# Altium schematic sheet LevelShifters_GPIOs.SchDoc
size A3; SheetNumber: 11; SheetTotal: 16
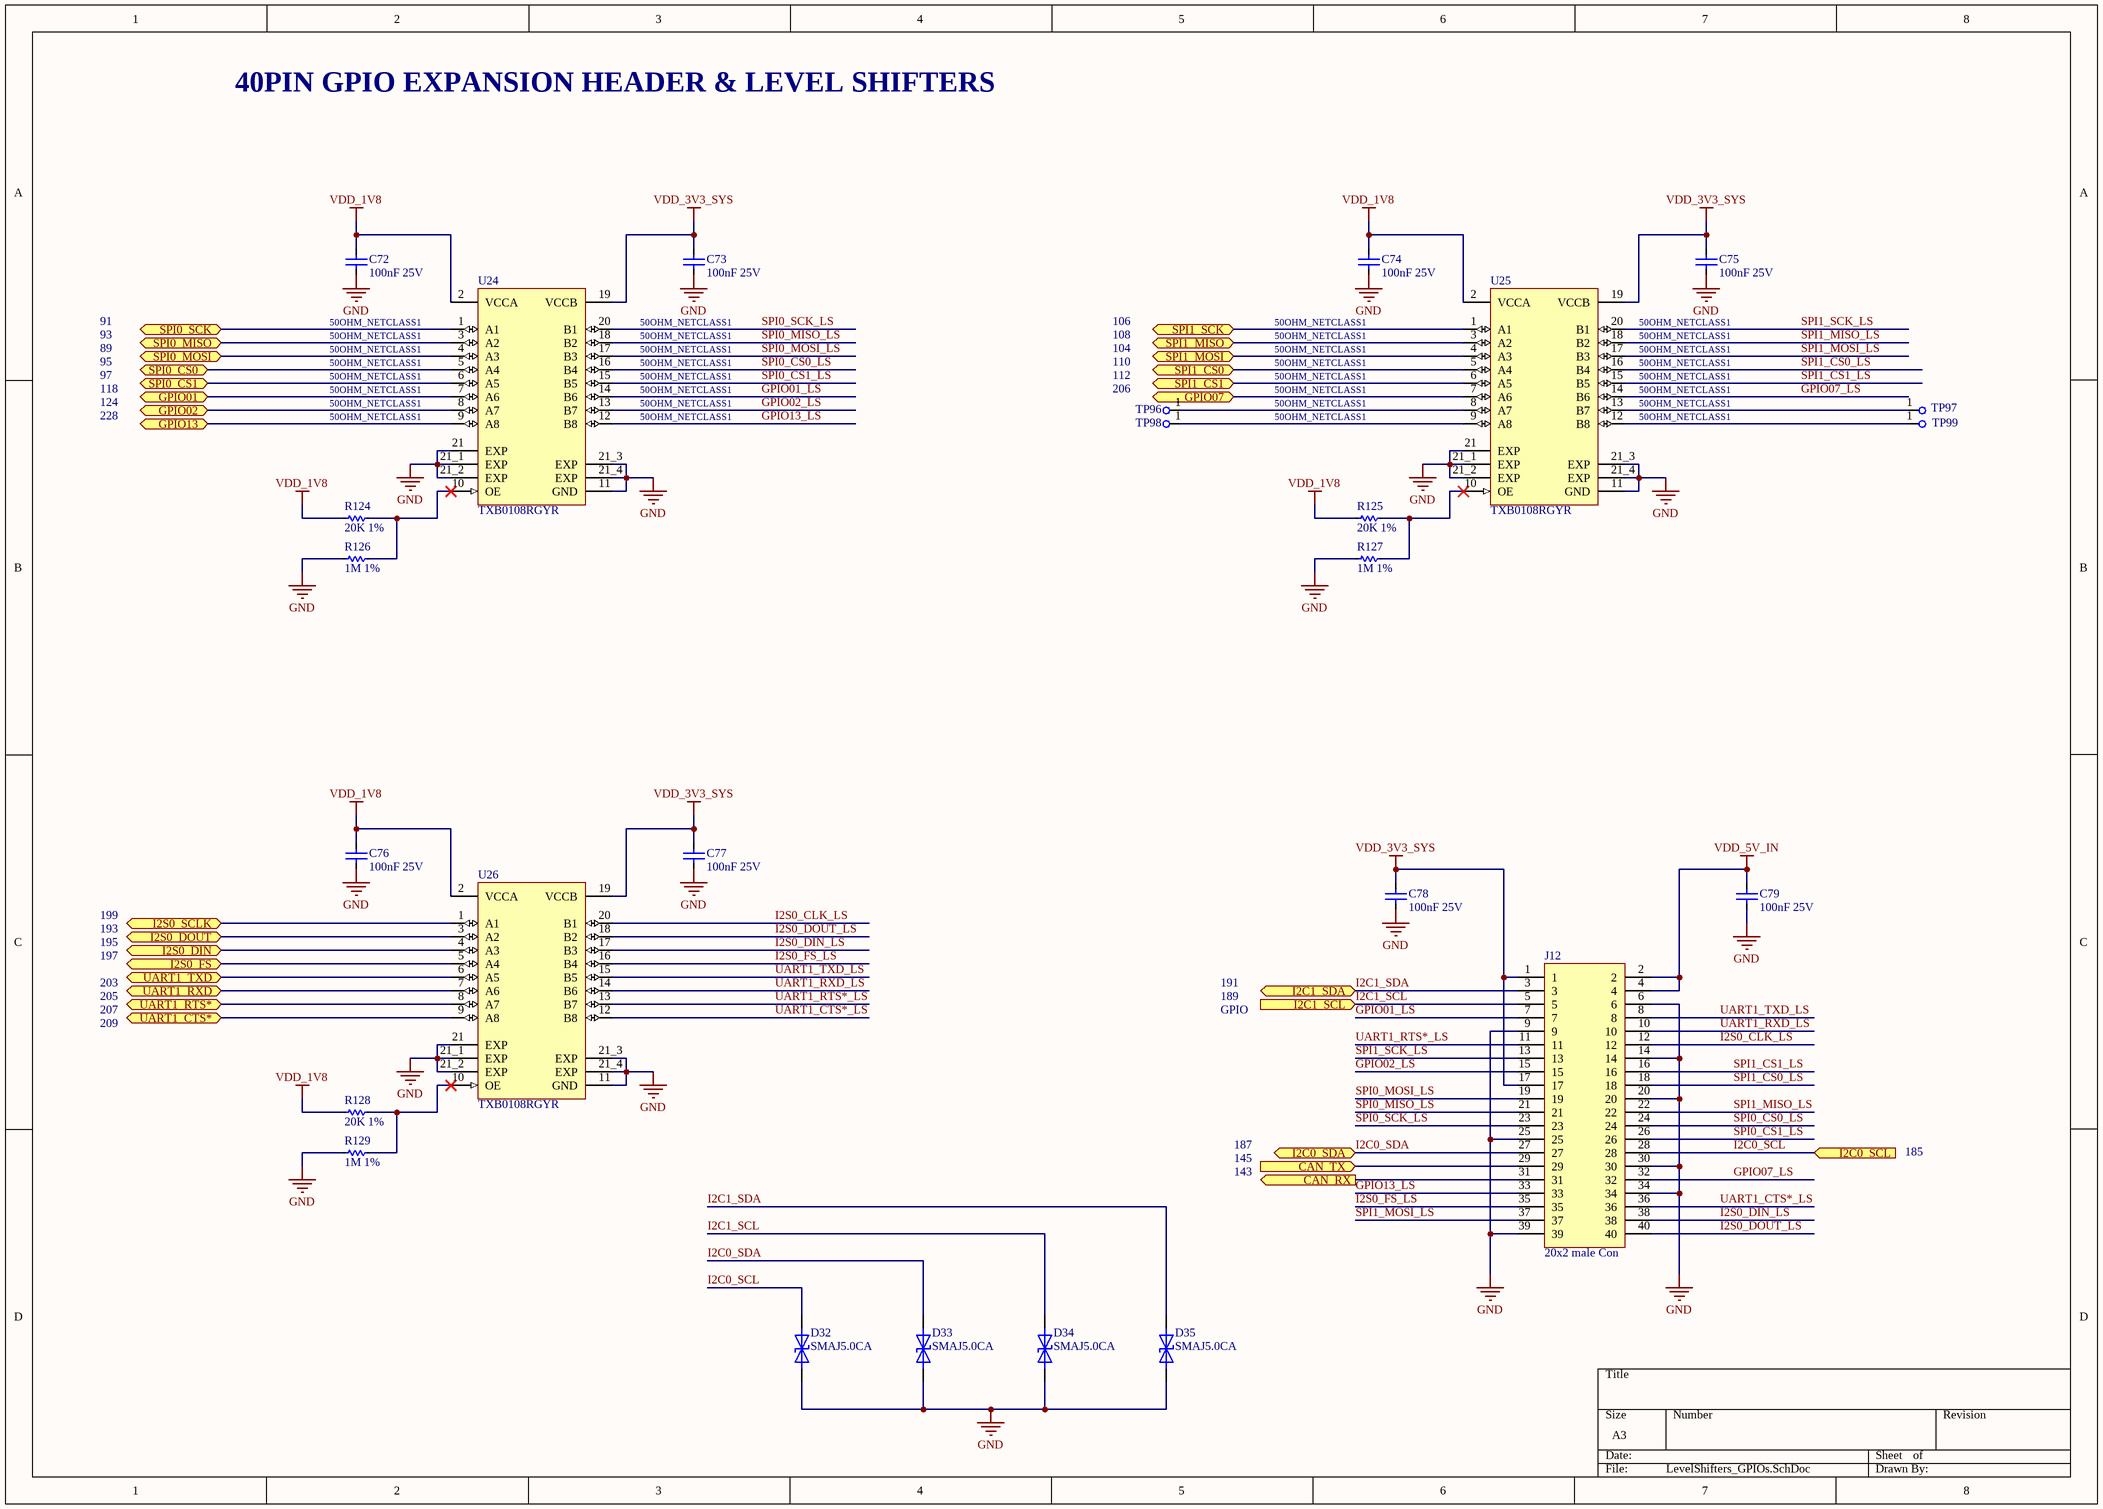
[diagram p0: LevelShifters_GPIOs.SchDoc]

## Parts
C72  100nF 25V  [C0402]
C73  100nF 25V  [C0402]
C74  100nF 25V  [C0402]
C75  100nF 25V  [C0402]
C76  100nF 25V  [C0402]
C77  100nF 25V  [C0402]
C78  100nF 25V  [C0402]
C79  100nF 25V  [C0402]
D32  SMAJ5.0CA  [DO-214AC]
D33  SMAJ5.0CA  [DO-214AC]
D34  SMAJ5.0CA  [DO-214AC]
D35  SMAJ5.0CA  [DO-214AC]
J12  20x2 male Con  [70246-4001]
R124  20K 1%  [R0402]
R125  20K 1%  [R0402]
R126  1M 1%  [R0402]
R127  1M 1%  [R0402]
R128  20K 1%  [R0402]
R129  1M 1%  [R0402]
TP96  (no value)  [TestPoint_Pad_D1.0mm]
TP97  TestPoint  [TestPoint_Pad_D1.0mm]  (value not drawn)
TP98  TestPoint  [TestPoint_Pad_D1.0mm]  (value not drawn)
TP99  TestPoint  [TestPoint_Pad_D1.0mm]  (value not drawn)
U24  TXB0108RGYR  [VQFN-20]
U25  TXB0108RGYR  [VQFN-20]
U26  TXB0108RGYR  [VQFN-20]

## Ports
CAN_RX (out), CAN_TX (in), GPIO01 (bidir), GPIO02 (bidir), GPIO07 (bidir), GPIO13 (bidir), I2C0_SCL (in), I2C0_SDA (bidir), I2C1_SCL (in), I2C1_SDA (bidir), I2S0_DIN (bidir), I2S0_DOUT (bidir), I2S0_FS (bidir), I2S0_SCLK (bidir), SPI0_CS0 (bidir), SPI0_CS1 (bidir), SPI0_MISO (bidir), SPI0_MOSI (bidir), SPI0_SCK (bidir), SPI1_CS0 (bidir), SPI1_CS1 (bidir), SPI1_MISO (bidir), SPI1_MOSI (bidir), SPI1_SCK (bidir), UART1_CTS* (bidir), UART1_RTS* (bidir), UART1_RXD (bidir), UART1_TXD (bidir)

## Nets
GND: C72.1 C73.1 C74.1 C75.1 C76.1 C77.1 C78.1 C79.1 D32.C D33.C D34.C D35.C J12.6 J12.9 J12.14 J12.20 J12.25 J12.30 J12.34 J12.39 R126.1 R127.1 R129.1 U24.11(GND) U24.21(EXP) U24.21_1(EXP) U24.21_2(EXP) U24.21_3(EXP) U24.21_4(EXP) U25.11(GND) U25.21(EXP) U25.21_1(EXP) U25.21_2(EXP) U25.21_3(EXP) U25.21_4(EXP) U26.11(GND) U26.21(EXP) U26.21_1(EXP) U26.21_2(EXP) U26.21_3(EXP) U26.21_4(EXP)
VDD_1V8: C72.2 C74.2 C76.2 R124.1 R125.1 R128.1 U24.2(VCCA) U25.2(VCCA) U26.2(VCCA)
VDD_3V3_SYS: C73.2 C75.2 C77.2 C78.2 J12.1 J12.17 U24.19(VCCB) U25.19(VCCB) U26.19(VCCB)
VDD_5V_IN: C79.2 J12.2 J12.4
CAN_RX: J12.31 ; port CAN_RX
CAN_TX: J12.29 ; port CAN_TX
GPIO01: U24.7(A6) ; port GPIO01
GPIO01_LS: J12.7 U24.14(B6)
GPIO02: U24.8(A7) ; port GPIO02
GPIO02_LS: J12.15 U24.13(B7)
GPIO07: U25.7(A6) ; port GPIO07
GPIO07_LS: J12.32 U25.14(B6)
GPIO13: U24.9(A8) ; port GPIO13
GPIO13_LS: J12.33 U24.12(B8)
I2C0_SCL: D32.A J12.28 ; port I2C0_SCL
I2C0_SDA: D33.A J12.27 ; port I2C0_SDA
I2C1_SCL: D34.A J12.5 ; port I2C1_SCL
I2C1_SDA: D35.A J12.3 ; port I2C1_SDA
I2S0_CLK_LS: J12.12 U26.20(B1)
I2S0_DIN: U26.4(A3) ; port I2S0_DIN
I2S0_DIN_LS: J12.38 U26.17(B3)
I2S0_DOUT: U26.3(A2) ; port I2S0_DOUT
I2S0_DOUT_LS: J12.40 U26.18(B2)
I2S0_FS: U26.5(A4) ; port I2S0_FS
I2S0_FS_LS: J12.35 U26.16(B4)
I2S0_SCLK: U26.1(A1) ; port I2S0_SCLK
SPI0_CS0: U24.5(A4) ; port SPI0_CS0
SPI0_CS0_LS: J12.24 U24.16(B4)
SPI0_CS1: U24.6(A5) ; port SPI0_CS1
SPI0_CS1_LS: J12.26 U24.15(B5)
SPI0_MISO: U24.3(A2) ; port SPI0_MISO
SPI0_MISO_LS: J12.21 U24.18(B2)
SPI0_MOSI: U24.4(A3) ; port SPI0_MOSI
SPI0_MOSI_LS: J12.19 U24.17(B3)
SPI0_SCK: U24.1(A1) ; port SPI0_SCK
SPI0_SCK_LS: J12.23 U24.20(B1)
SPI1_CS0: U25.5(A4) ; port SPI1_CS0
SPI1_CS0_LS: J12.18 U25.16(B4)
SPI1_CS1: U25.6(A5) ; port SPI1_CS1
SPI1_CS1_LS: J12.16 U25.15(B5)
SPI1_MISO: U25.3(A2) ; port SPI1_MISO
SPI1_MISO_LS: J12.22 U25.18(B2)
SPI1_MOSI: U25.4(A3) ; port SPI1_MOSI
SPI1_MOSI_LS: J12.37 U25.17(B3)
SPI1_SCK: U25.1(A1) ; port SPI1_SCK
SPI1_SCK_LS: J12.13 U25.20(B1)
UART1_CTS*: U26.9(A8) ; port UART1_CTS*
UART1_CTS*_LS: J12.36 U26.12(B8)
UART1_RTS*: U26.8(A7) ; port UART1_RTS*
UART1_RTS*_LS: J12.11 U26.13(B7)
UART1_RXD: U26.7(A6) ; port UART1_RXD
UART1_RXD_LS: J12.10 U26.14(B6)
UART1_TXD: U26.6(A5) ; port UART1_TXD
UART1_TXD_LS: J12.8 U26.15(B5)
NetR124_2: R124.2 R126.2 U24.10(OE)
NetR125_2: R125.2 R127.2 U25.10(OE)
NetR128_2: R128.2 R129.2 U26.10(OE)
NetTP96_1: TP96.1 U25.8(A7)
NetTP97_1: TP97.1 U25.13(B7)
NetTP98_1: TP98.1 U25.9(A8)
NetTP99_1: TP99.1 U25.12(B8)

## Notes on the sheet
- 40PIN GPIO EXPANSION HEADER & LEVEL SHIFTERS
- 91
- 93
- 89
- 95
- 97
- 50OHM_NETCLASS1
- 106
- 108
- 104
- 110
- 112
- (near U25) 50OHM_NETCLASS1
- 118
- 124
- 228
- 206
- 199
- 203
- 193
- 195
- 197
- 191
- 205
- 207
- 209
- 189
- GPIO
- 187
- 145
- 143
- 185

## Library data of the parts
C72-C79 = TMK105BJ104KV-F: CAP CER 0.1UF 25V X5R 0402 / High Value Multilayer Ceramic Capacitors (High dielectric type); Manufacturer: Taiyo Yuden; Tolerance: 10%; Supplier 1: Digi-Key; Manufacturer Part Number: TMK105BJ104KV-F; RoHS: Yes; Category: Ceramic Capacitors; Stock 1: 11997960; Pricing 1: 1=0.10000, 10=0.03700, 50=0.02000, 100=0.01630, 500=0.01166, 1000=0.00917, 2500=0.00833, 5000=0.00767 (USD); Mount: Surface Mount; Case/Package: 0402; Number of Pins: 2; Case Code (Imperial): 0402; Case Code (Metric): 1005; Weight: 2.3E-05oz; Min Operating Temperature: -55°C; Max Operating Temperature: 85°C; Capacitance: 100nF; Packaging: Tape and Reel; Dielectric: X5R; Voltage Rating (DC): 25V; Voltage Rating: 25V; Package Quantity: 1; Termination: SMD/SMT; Resistor Type: Ceramic; Voltage: 25V; Series: M; Construction: Flat; Length: 1mm; Width: 0.02inch; Height: 0.5mm; Depth: 0.5mm; Thickness: 0.022inch; Reach SVHC Compliant: Yes; Lead Free: Lead Free; Halogen Free: Halogen Free; RoHS Compliant: Yes; Supplier Part Number 1: 587-1456-1-ND
D32-D35 = SMAJ5.0CA: Transient Voltage Suppressor, TVS, SMAJ Series, Bidirectional, 5 V, DO-214AC, 2, 6.4 V RoHS Compliant: Yes; Manufacturer: Littelfuse; Reverse Breakdown Voltage: 6.4V; Operating Supply Voltage: 5V; Max Surge Current: 43.5A; Number of Elements: 1; Clamping Voltage: 9.2V; Peak Pulse Power: 400W; Power Line Protection: No; Test Current: 10mA; Max Reverse Leakage Current: 800uA; Max Breakdown Voltage: 7V; Max Power Dissipation: 3.3W; Element Configuration: Single; Leakage Current: 1.6mA; Capacitance: 1.05nF; Diode Type: ZENER; Supplier 1: Digi-Key; Manufacturer Part Number: SMAJ5.0CA; RoHS: Yes; Category: TVS Diodes; Stock 1: 526420; Pricing 1: 1=0.43000, 10=0.32000, 100=0.19950, 500=0.13650, 1000=0.10500, 2000=0.09450 (USD); Mount: Surface Mount; Case/Package: DO-214AC; Number of Pins: 2; Min Operating Temperature: -65°C; Max Operating Temperature: 150°C; Package Quantity: 5000; Direction: Bidirectional; Packaging: Tape and Reel; Number of Bidirectional Channels: 1; Reverse Standoff Voltage: 5V; Min Breakdown Voltage: 6.4V; Breakdown Voltage: 6.4V; Number of Channels: 1; Polarity: Bidirectional; Termination: SMD/SMT; Peak Pulse Current: 43.5A; Power Dissipation: 400W; Voltage Rating (DC): 5V; Max Output Current: 43.5A; Resistor Type: Zener; Series: SMAJ; Clamping Voltage-Max: 9.2V; Length: 4.5mm; Width: 2.79mm; Height: 2.087mm; Radiation Hardening: No; Reach SVHC Compliant: Yes; Lead Free: Lead Free; RoHS Compliant: Yes; ComponentLink1URL: https://datasheet.ciiva.com/25624/0900766b810f4edb-25624837.pdf?src-supplier=Rs; ComponentLink1Description: https://datasheet.ciiva.com/25624/0900766b810f4edb-25624837.pdf?src-supplier=Rs; ComponentLink2URL: https://datasheet.ciiva.com/28473/607617-28473438.pdf?src-supplier=Element14; ComponentLink2Description: https://datasheet.ciiva.com/28473/607617-28473438.pdf?src-supplier=Element14; ComponentLink3URL: https://datasheet.ciiva.com/16206/littelfuse-tvs-diode-smaj-16206104.pdf?src-supplier=Future+Electronics; ComponentLink3Description: https://datasheet.ciiva.com/16206/littelfuse-tvs-diode-smaj-16206104.pdf?src-supplier=Future+Electronics; ComponentLink4URL: https://datasheet.ciiva.com/331/littelfuse-tvs-diode-smaj-datasheet-pdf-331055.pdf?src-supplier=Digi-Key; ComponentLink4Description: https://datasheet.ciiva.com/331/littelfuse-tvs-diode-smaj-datasheet-pdf-331055.pdf?src-supplier=Digi-Key; ComponentLink5URL: https://datasheet.ciiva.com/331/littelfuse-tvs-diode-smaj-datasheet-pdf-331056.pdf?src-supplier=Digi-Key; ComponentLink5Description: https://datasheet.ciiva.com/331/littelfuse-tvs-diode-smaj-datasheet-pdf-331056.pdf?src-supplier=Digi-Key; ComponentLink6URL: https://datasheet.ciiva.com/331/littelfuse-tvs-diode-smaj-datasheet-pdf-331054.pdf?src-supplier=Digi-Key; ComponentLink6Description: https://datasheet.ciiva.com/331/littelfuse-tvs-diode-smaj-datasheet-pdf-331054.pdf?src-supplier=Digi-Key; Supplier Part Number 1: SMAJ5.0CALFCT-ND
J12 = 0702464001: Conn Shrouded Header (4 Sides) HDR 40 POS 2.54mm Solder ST Thru-Hole C-Grid® Frame; Manufacturer: Molex; Supplier 1: Digi-Key; Manufacturer Part Number: 0702464001; RoHS: Yes; Category: Uncategorized; Stock 1: 9741; Pricing 1: 1=4.29000, 10=3.77400, 400=3.00210, 1200=2.48745 (USD); ComponentLink1URL: https://datasheet.ciiva.com/6814/702461001-sd-6814000.pdf?src-supplier=Digi-Key; ComponentLink1Description: https://datasheet.ciiva.com/6814/702461001-sd-6814000.pdf?src-supplier=Digi-Key; Supplier Part Number 1: WM6550-ND
R124 R125 R128 = AC0402FR-0720KL: Res Thick Film 0402 20K Ohm 1% 0.063W(1/16W) ±100ppm/C Pad SMD Automotive T/R; Manufacturer: Yageo; Power Rating: 62.5mW; Resistance: 20kR; Voltage Rating: 50V; Max Power Dissipation: 63mW; Temperature Coefficient: 100ppm/°C; Supplier 1: Digi-Key; Manufacturer Part Number: AC0402FR-0720KL; RoHS: Yes; Category: Chip SMD Resistors; Stock 1: 682198; Pricing 1: 1=0.10000, 10=0.01900, 100=0.00790, 1000=0.00353, 2500=0.00307, 5000=0.00253 (USD); Case/Package: 0402; Case Code (Imperial): 0402; Case Code (Metric): 1005; Min Operating Temperature: -55°C; Max Operating Temperature: 155°C; Packaging: Tape and Reel; Tolerance: 1%; Resistor Type: Thick Film; Number of Terminations: 2; Termination: SMD/SMT; Features: Moisture Resistant,Automotive AEC-Q200; Series: AC; Length: 0.039inch; Width: 0.02inch; Height: 0.015inch; RoHS Compliant: Yes; ComponentLink1URL: http://www.mouser.com/ds/2/447/yageodocoutput-1111992.pdf?src-supplier=Mouser; ComponentLink1Description: http://www.mouser.com/ds/2/447/yageodocoutput-1111992.pdf?src-supplier=Mouser; ComponentLink2URL: http://www.yageo.com/NewPortal/yageodocoutput?fileName=/pdf/R-Chip/PYu-AC_51_RoHS_L_6.pdf&src-supplier=Digi-Key; ComponentLink2Description: http://www.yageo.com/NewPortal/yageodocoutput?fileName=/pdf/R-Chip/PYu-AC_51_RoHS_L_6.pdf&src-supplier=Digi-Key; Supplier Part Number 1: YAG3454CT-ND
R126 R127 R129 = AC0402FR-071ML: RES SMD 1M OHM 1% 1/16W 0402; Manufacturer: Yageo; Power Rating: 62.5mW; Resistance: 1MR; Voltage Rating: 50V; Temperature Coefficient: 100ppm/°C; Max Power Dissipation: 63mW; Supplier 1: Digi-Key; Manufacturer Part Number: AC0402FR-071ML; RoHS: Yes; Category: Chip SMD Resistors; Stock 1: 684587; Pricing 1: 1=0.10000, 10=0.01900, 100=0.00790, 1000=0.00353, 2500=0.00307, 5000=0.00253 (USD); Case/Package: 0402; Case Code (Imperial): 0402; Case Code (Metric): 1005; Size Code: 0402; Min Operating Temperature: -55°C; Max Operating Temperature: 155°C; Packaging: Tape and Reel; Tolerance: 1%; Termination: SMD/SMT; Resistor Type: Thick Film; Number of Terminations: 2; Features: Moisture Resistant,Automotive AEC-Q200; Series: AC; Construction: Rectangular; Length: 1mm; Width: 0.5mm; Height: 0.015inch; Depth: 0.5mm; Military Standard: Not; Lead Free: Lead Free; RoHS Compliant: Yes; ComponentLink1URL: http://www.yageo.com/documents/recent/PYu-AC_51_RoHS_L_2.pdf?src-supplier=Mouser; ComponentLink1Description: http://www.yageo.com/documents/recent/PYu-AC_51_RoHS_L_2.pdf?src-supplier=Mouser; ComponentLink2URL: http://www.yageo.com/documents/recent/PYu-AC_51_RoHS_L_2_revised.pdf?src-supplier=Future+Electronics; ComponentLink2Description: http://www.yageo.com/documents/recent/PYu-AC_51_RoHS_L_2_revised.pdf?src-supplier=Future+Electronics; ComponentLink3URL: http://www.yageo.com/NewPortal/yageodocoutput?fileName=/pdf/R-Chip/PYu-AC_51_RoHS_L_6.pdf&src-supplier=Digi-Key; ComponentLink3Description: http://www.yageo.com/NewPortal/yageodocoutput?fileName=/pdf/R-Chip/PYu-AC_51_RoHS_L_6.pdf&src-supplier=Digi-Key; Supplier Part Number 1: YAG3450CT-ND
TP96-TP99 = TestPoint_D1mm
U24-U26 = TXB0108RGYR: IC 8-BIT TRNSLTR 15KV ESD 20VQFN; Manufacturer: Texas Instruments; Data Rate: 100Mbps; Number of Channels: 8; Propagation Delay: 9.5ns; Max Supply Voltage: 5.5V; Min Supply Voltage: 1.2V; Logic Function: Translator; Turn-On Delay Time: 35.6ns; Low Level Output Current: 20uA; High Level Output Current: -20uA; Quiescent Current: 3.5uA; Output Type: 3-STATE; Rise Time: 0.8ns; Nominal Supply Current: 10uA; Channel Type: Bidirectional; Number of Circuits: 1; Supplier 1: Mouser; Manufacturer Part Number: TXB0108RGYR; RoHS: Yes; Category: Voltage Level Shifters; Stock 1: 23719; Pricing 1: 1=1.63000, 10=1.46000, 50=1.38000, 100=1.18000, 1000=0.80200, 10000=0.80100 (USD); Mount: Surface Mount; Case/Package: VQFN EP; Number of Pins: 20; Weight: 0.001517oz; Contact Plating: Gold; Min Operating Temperature: -40°C; Max Operating Temperature: 85°C; Package Quantity: 3000; Packaging: Tape and Reel; Number of Bits: 8; Output Current: 20uA; Series: -; Number of Inputs: 8; Termination: SMD/SMT; Supply Current: 10uA; Length: 4.5mm; Width: 3.5mm; Height: 0.8mm; Radiation Hardening: No; Lead Free: Lead Free; RoHS Compliant: Yes; Reach SVHC Compliant: Yes; ComponentLink1URL: https://datasheet.ciiva.com/15096/getdatasheetpartid-172984-15096214.pdf?src-supplier=Verical; ComponentLink1Description: https://datasheet.ciiva.com/15096/getdatasheetpartid-172984-15096214.pdf?src-supplier=Verical; ComponentLink2URL: https://datasheet.ciiva.com/1508/1811182-1508728.pdf?src-supplier=Element14; ComponentLink2Description: https://datasheet.ciiva.com/1508/1811182-1508728.pdf?src-supplier=Element14; ComponentLink3URL: https://datasheet.ciiva.com/1899/txb0108-1899602.pdf?src-supplier=Digi-Key; ComponentLink3Description: https://datasheet.ciiva.com/1899/txb0108-1899602.pdf?src-supplier=Digi-Key; ComponentLink4URL: https://datasheet.ciiva.com/1899/txb0108-1899601.pdf?src-supplier=Digi-Key; ComponentLink4Description: https://datasheet.ciiva.com/1899/txb0108-1899601.pdf?src-supplier=Digi-Key; ComponentLink5URL: https://datasheet.ciiva.com/1899/txb0108-1899603.pdf?src-supplier=Digi-Key; ComponentLink5Description: https://datasheet.ciiva.com/1899/txb0108-1899603.pdf?src-supplier=Digi-Key; Supplier Part Number 1: 595-TXB0108RGYR